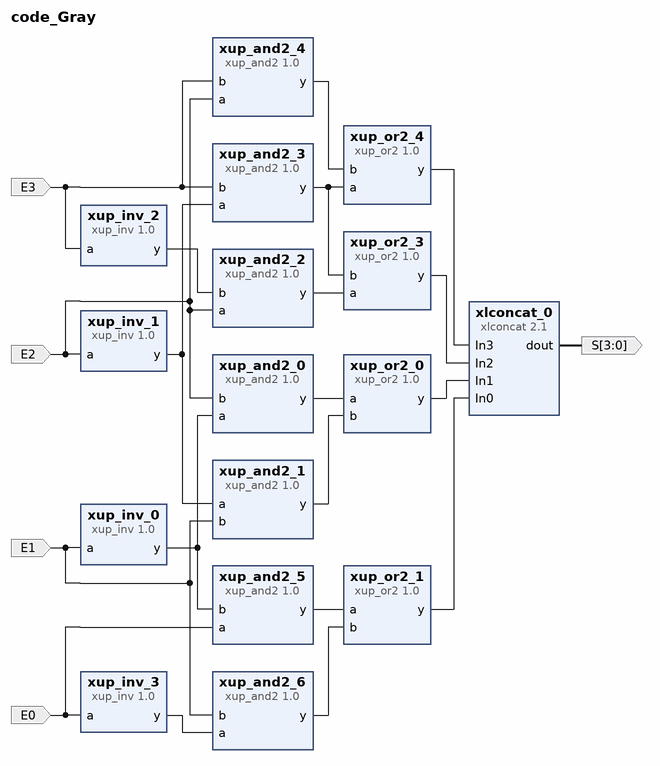
[diagram p0: block diagram of the top level]
# Vivado block design code_Gray, xc7a100tcsg324-1, Vivado 2018.3
create_bd_design code_Gray

create_bd_port -dir I E0
create_bd_port -dir I E1
create_bd_port -dir I E2
create_bd_port -dir I E3
create_bd_port -dir O -from 3 -to 0 S

create_bd_cell -type ip -vlnv xilinx.com:ip:xlconcat:2.1 xlconcat_0
set_property -dict {CONFIG.NUM_PORTS 4} [get_bd_cells xlconcat_0]
create_bd_cell -type ip -vlnv xilinx.com:xup:xup_and2:1.0 xup_and2_0
create_bd_cell -type ip -vlnv xilinx.com:xup:xup_and2:1.0 xup_and2_1
create_bd_cell -type ip -vlnv xilinx.com:xup:xup_and2:1.0 xup_and2_2
create_bd_cell -type ip -vlnv xilinx.com:xup:xup_and2:1.0 xup_and2_5
create_bd_cell -type ip -vlnv xilinx.com:xup:xup_and2:1.0 xup_and2_3
create_bd_cell -type ip -vlnv xilinx.com:xup:xup_and2:1.0 xup_and2_4
create_bd_cell -type ip -vlnv xilinx.com:xup:xup_and2:1.0 xup_and2_6
create_bd_cell -type ip -vlnv xilinx.com:xup:xup_inv:1.0 xup_inv_0
create_bd_cell -type ip -vlnv xilinx.com:xup:xup_inv:1.0 xup_inv_1
create_bd_cell -type ip -vlnv xilinx.com:xup:xup_inv:1.0 xup_inv_3
create_bd_cell -type ip -vlnv xilinx.com:xup:xup_inv:1.0 xup_inv_2
create_bd_cell -type ip -vlnv xilinx.com:xup:xup_or2:1.0 xup_or2_0
create_bd_cell -type ip -vlnv xilinx.com:xup:xup_or2:1.0 xup_or2_1
create_bd_cell -type ip -vlnv xilinx.com:xup:xup_or2:1.0 xup_or2_3
create_bd_cell -type ip -vlnv xilinx.com:xup:xup_or2:1.0 xup_or2_4

# ---- connections ----

connect_bd_net -net E1_1 [get_bd_ports E1] [get_bd_pins xup_and2_1/b] [get_bd_pins xup_and2_6/b] [get_bd_pins xup_inv_0/a]
connect_bd_net -net E2_1 [get_bd_ports E2] [get_bd_pins xup_and2_0/b] [get_bd_pins xup_and2_2/a] [get_bd_pins xup_and2_4/a] [get_bd_pins xup_inv_1/a]
connect_bd_net [get_bd_pins xup_and2_0/y] [get_bd_pins xup_or2_0/a]
connect_bd_net [get_bd_pins xup_inv_1/y] [get_bd_pins xup_and2_1/a] [get_bd_pins xup_and2_3/a]
connect_bd_net [get_bd_pins xup_and2_1/y] [get_bd_pins xup_or2_0/b]
connect_bd_net -net E3_1 [get_bd_ports E3] [get_bd_pins xup_and2_3/b] [get_bd_pins xup_and2_4/b] [get_bd_pins xup_inv_2/a]
connect_bd_net [get_bd_pins xup_inv_2/y] [get_bd_pins xup_and2_2/b]
connect_bd_net [get_bd_pins xup_and2_2/y] [get_bd_pins xup_or2_3/a]
connect_bd_net [get_bd_pins xup_and2_3/y] [get_bd_pins xup_or2_3/b] [get_bd_pins xup_or2_4/a]
connect_bd_net [get_bd_pins xup_and2_4/y] [get_bd_pins xup_or2_4/b]
connect_bd_net [get_bd_pins xup_or2_0/y] [get_bd_pins xlconcat_0/In1]
connect_bd_net [get_bd_pins xup_or2_3/y] [get_bd_pins xlconcat_0/In2]
connect_bd_net [get_bd_pins xup_or2_4/y] [get_bd_pins xlconcat_0/In3]
connect_bd_net [get_bd_pins xlconcat_0/dout] [get_bd_ports S]
connect_bd_net [get_bd_pins xup_or2_1/y] [get_bd_pins xlconcat_0/In0]
connect_bd_net [get_bd_pins xup_inv_0/y] [get_bd_pins xup_and2_0/a] [get_bd_pins xup_and2_5/b]
connect_bd_net [get_bd_pins xup_and2_5/y] [get_bd_pins xup_or2_1/a]
connect_bd_net -net E0_1 [get_bd_ports E0] [get_bd_pins xup_and2_5/a] [get_bd_pins xup_inv_3/a]
connect_bd_net [get_bd_pins xup_inv_3/y] [get_bd_pins xup_and2_6/a]
connect_bd_net [get_bd_pins xup_and2_6/y] [get_bd_pins xup_or2_1/b]

validate_bd_design
save_bd_design
